# Altium schematic sheet POWER_3.SchDoc
size 420 x 297 mm; SheetNumber: 9; SheetTotal: 24
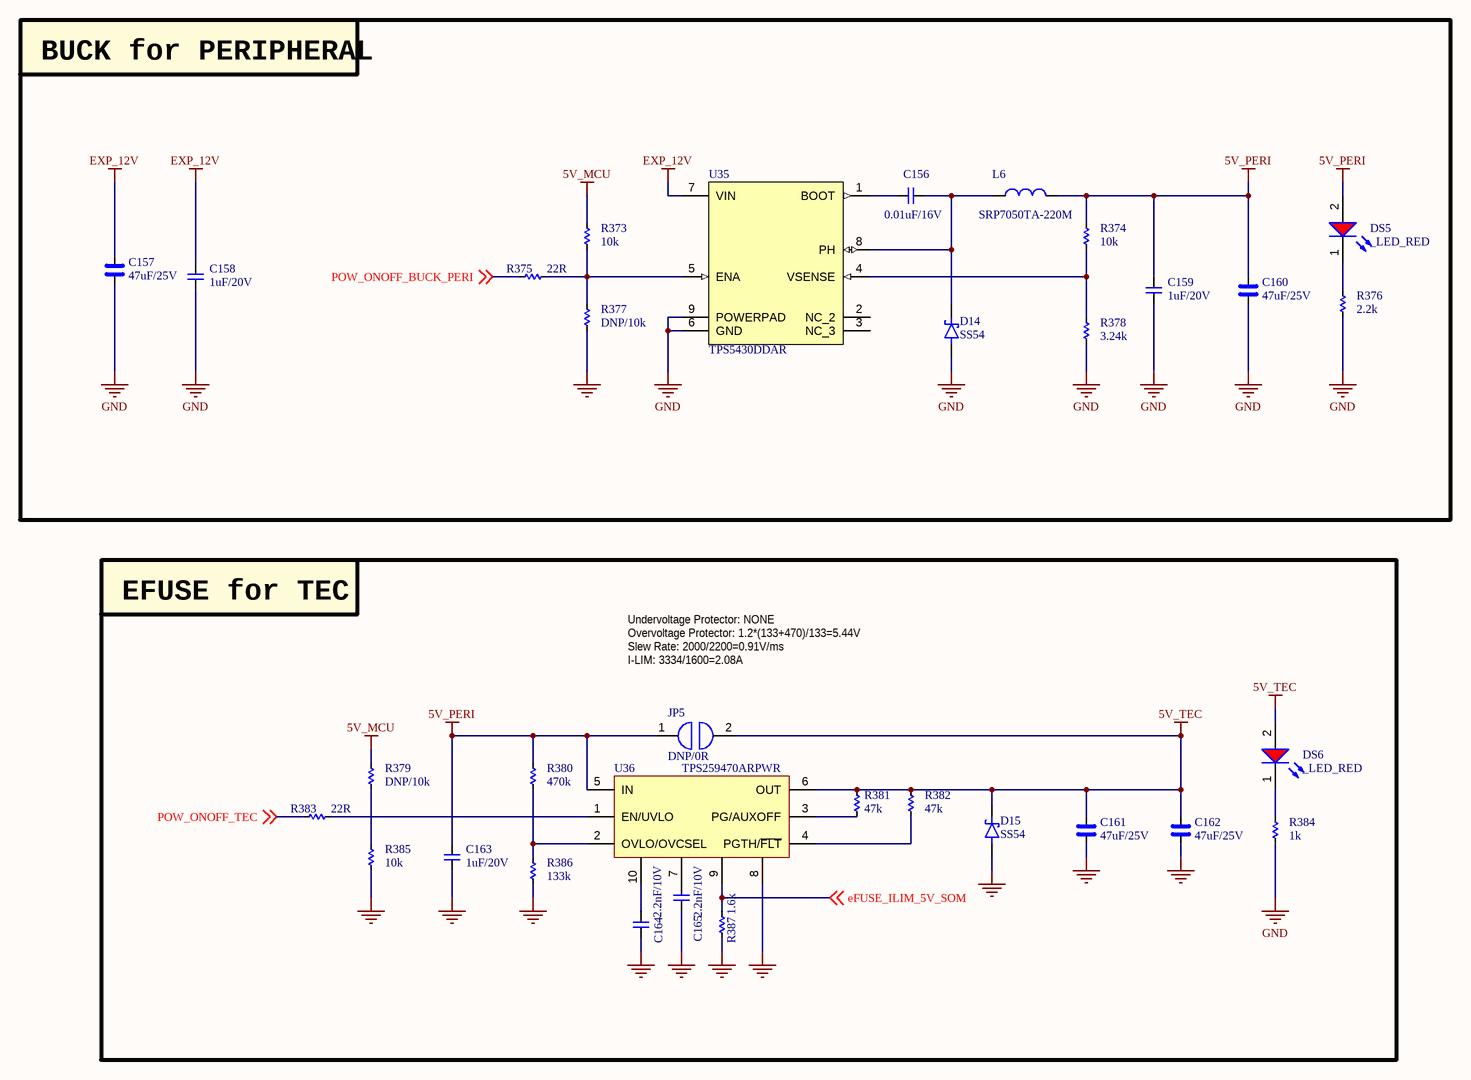
[diagram p0: POWER_3.SchDoc]

## Parts
C156  0.01uF/16V  [CAP_C_1005X60]
C157  47uF/25V  [CAP_C_3225X80]
C158  1uF/20V  [CAP_C_1005X60]
C159  1uF/20V  [CAP_C_1005X60]
C160  47uF/25V  [CAP_C_3225X80]
C161  47uF/25V  [CAP_C_3225X80]
C162  47uF/25V  [CAP_C_3225X80]
C163  1uF/20V  [CAP_C_1005X60]
C164  2.2nF/10V  [CAP_C_1005X60]
C165  2.2nF/10V  [CAP_C_1005X60]
D14  SS54  [DO-214AC_SMA]
D15  SS54  [DO-214AC_SMA]
DS5  _LED_RED  [LED_0402]
DS6  _LED_RED  [LED_0402]
JP5  DNP/0R  [RES_C_1608X60]
L6  SRP7050TA-220M  [PSM6050]
R373  10k  [RES_C_1005X40]
R374  10k  [RES_C_1005X40]
R375  22R  [RES_C_1005X40]
R376  2.2k  [RES_C_1005X40]
R377  DNP/10k  [RES_C_1005X40]
R378  3.24k  [RES_C_1005X40]
R379  DNP/10k  [RES_C_1005X40]
R380  470k  [RES_C_1005X40]
R381  47k  [RES_C_1005X40]
R382  47k  [RES_C_1005X40]
R383  22R  [RES_C_1005X40]
R384  1k  [RES_C_1005X40]
R385  10k  [RES_C_1005X40]
R386  133k  [RES_C_1005X40]
R387  1.6k  [RES_C_1005X40]
U35  TPS5430DDAR  [TPS5430DDAR_V3]
U36  TPS259470ARPWR  [VQFN-HR-10]

## Blocks framed on the sheet
BUCK for PERIPHERAL: C156-C160 D14 DS5 L6 R373-R378 U35
EFUSE for TEC: C161-C165 D15 DS6 JP5 R379-R387 U36

## Nets
5V_MCU: R373.1 R379.1
5V_PERI: C159.2 C160.2 C163.2 DS5.2(A) JP5.1 L6.2 R374.2 R380.2 U36.5(IN)
5V_TEC: C161.2 C162.2 D15.1(K) DS6.2(A) JP5.2 R381.2 R382.2 U36.6(OUT)
EXP_12V: C157.2 C158.2 U35.7(VIN)
GND: C157.1 C158.1 C159.1 C160.1 C161.1 C162.1 C163.1 C164.1 C165.1 D14.2(A) D15.2(A) R376.1 R377.2 R378.1 R384.1 R385.2 R386.1 R387.1 U35.6(GND) U35.9(POWERPAD) U36.8
eFUSE_ILIM_5V_SOM: R387.2 U36.9 ; off-sheet eFUSE_ILIM_5V_SOM
POW_ONOFF_BUCK_PERI: R375.2 ; off-sheet POW_ONOFF_BUCK_PERI
POW_ONOFF_TEC: R383.2 ; off-sheet POW_ONOFF_TEC
NetC156_1: C156.1 D14.1(K) L6.1 U35.8(PH)
NetC156_2: C156.2 U35.1(BOOT)
NetC164_2: C164.2 U36.10
NetC165_2: C165.2 U36.7
NetDS5_1: DS5.1(K) R376.2
NetDS6_1: DS6.1(K) R384.2
NetR373_2: R373.2 R375.1 R377.1 U35.5(ENA)
NetR374_1: R374.1 R378.2 U35.4(VSENSE)
NetR379_2: R379.2 R385.1
NetR380_1: R380.1 R386.2 U36.2(OVLO/OVCSEL)
NetR381_1: R381.1 U36.3(PG/AUXOFF)
NetR382_1: R382.1 U36.4(PGTH/~{FLT})
NetR383_1: R383.1 U36.1(EN/UVLO)

Not connected (* = marked no-connect by the designer): U35 2(NC_2) 3(NC_3)

## Notes on the sheet
- Undervoltage Protector: NONE
- Overvoltage Protector: 1.2*(133+470)/133=5.44V
- Slew Rate: 2000/2200=0.91V/ms
- I-LIM: 3334/1600=2.08A
- Project:
- BEE-PC1
- Sub-system:
- NANORACK_EXP_CONTROLLER
- Design by:
- SANG HUYNH
- BAO BUI Q.
- Sheet title:
- Sheet
- A3
- of
- Checked by:
- Approved by:
- VU PHAM
- Revision:
- Document No:
- V1.2.2
- Size:
- Date:

## Library data of the parts
C156 C158 C159 C163-C165 = _CAP_C_2: CAP CHIP
C157 C160-C162 = _CAP_C_High_2: CAP CHIP High Value
D14 D15 = DIODE SCHOTTKY
JP5 = JUMPER
L6 = SRP7050TA-220M: FIXED IND 22UH 2.5A 170 MOHM SMD
R373-R387 = _RES_B_2: RES
U35 = TPS5430DDAR: IC REG BUCK ADJ 3A 8SOPWR